# Altium schematic sheet Transformer.SchDoc
size 406 x 304 mm; SheetNumber: 1; SheetTotal: 4
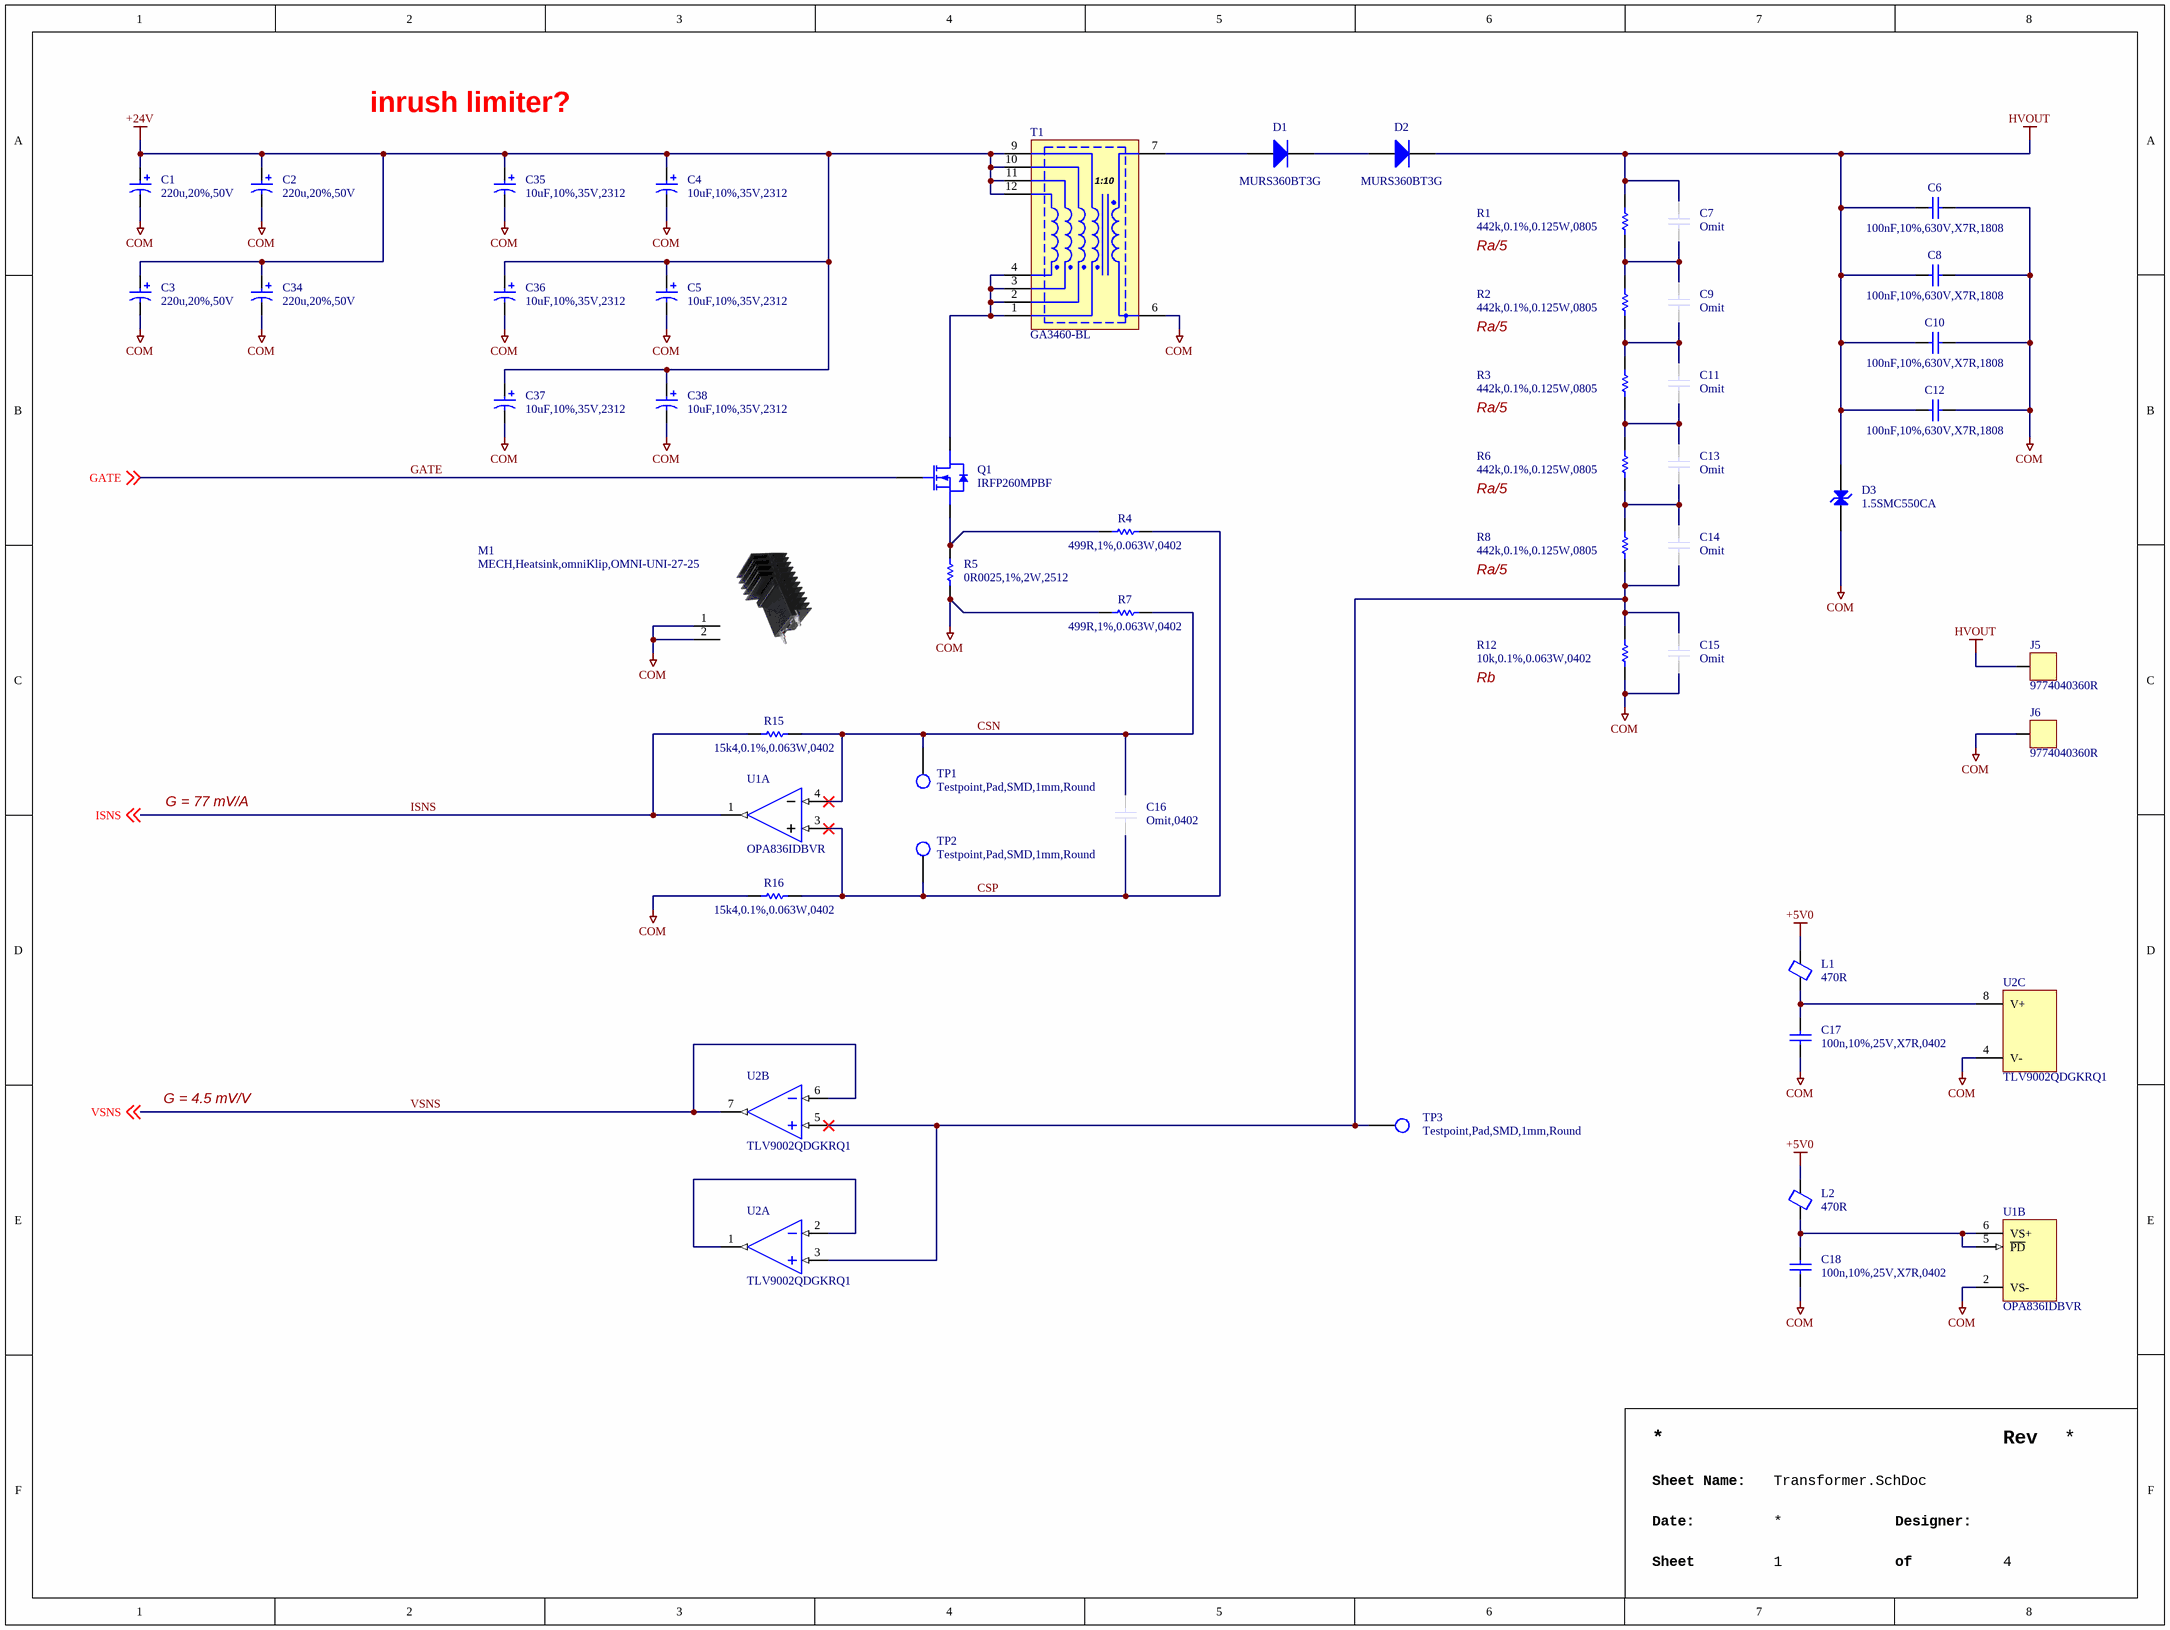
[diagram p0: Transformer.SchDoc]

## Parts
C1  220u,20%,50V  [CAPPR500W60D1000H1600B]
C2  220u,20%,50V  [CAPPR500W60D1000H1600B]
C3  220u,20%,50V  [CAPPR500W60D1000H1600B]
C4  10uF,10%,35V,2312  [KYOCERA_PKG_TAJC]
C5  10uF,10%,35V,2312  [KYOCERA_PKG_TAJC]
C6  100nF,10%,630V,X7R,1808  [KEMET_PKG_LC]
C7  Omit  [CAPC_0805]  (no BOM)
C8  100nF,10%,630V,X7R,1808  [KEMET_PKG_LC]
C9  Omit  [CAPC_0805]  (no BOM)
C10  100nF,10%,630V,X7R,1808  [KEMET_PKG_LC]
C11  Omit  [CAPC_0805]  (no BOM)
C12  100nF,10%,630V,X7R,1808  [KEMET_PKG_LC]
C13  Omit  [CAPC_0805]  (no BOM)
C14  Omit  [CAPC_0805]  (no BOM)
C15  Omit  [CAPC_0805]  (no BOM)
C16  Omit,0402  [CAPC1005X06N]  (no BOM)
C17  100n,10%,25V,X7R,0402  [CAPC1005X06N]
C18  100n,10%,25V,X7R,0402  [CAPC1005X06N]
C34  220u,20%,50V  [CAPPR500W60D1000H1600B]
C35  10uF,10%,35V,2312  [KYOCERA_PKG_TAJC]
C36  10uF,10%,35V,2312  [KYOCERA_PKG_TAJC]
C37  10uF,10%,35V,2312  [KYOCERA_PKG_TAJC]
C38  10uF,10%,35V,2312  [KYOCERA_PKG_TAJC]
D1  MURS360BT3G  [ONSEMI_SMB]
D2  MURS360BT3G  [ONSEMI_SMB]
D3  1.5SMC550CA  [LITTELFUSE_DO-214AB]
J5  9774040360R  [WURTH_9774040360R]
J6  9774040360R  [WURTH_9774040360R]
L1  470R  [INDC1005X05N]
L2  470R  [INDC1005X05N]
M1  MECH,Heatsink,omniKlip,OMNI-UNI-27-25  [WAKEFIELD_OMNI-UNI-27-25]
Q1  IRFP260MPBF  [INFINEON_PKG_TO247AD]
R1  442k,0.1%,0.125W,0805  [RESC2012X07N]
R2  442k,0.1%,0.125W,0805  [RESC2012X07N]
R3  442k,0.1%,0.125W,0805  [RESC2012X07N]
R4  499R,1%,0.063W,0402  [RESC1005X04N]
R5  0R0025,1%,2W,2512  [RALEC_PKG_2512]
R6  442k,0.1%,0.125W,0805  [RESC2012X07N]
R7  499R,1%,0.063W,0402  [RESC1005X04N]
R8  442k,0.1%,0.125W,0805  [RESC2012X07N]
R12  10k,0.1%,0.063W,0402  [RESC1005X04N]
R15  15k4,0.1%,0.063W,0402  [RESC1005X04N]
R16  15k4,0.1%,0.063W,0402  [RESC1005X04N]
T1  GA3460-BL  [COILCRAFT_GA3460-BL]
TP1  Testpoint,Pad,SMD,1mm,Round  [TP100]
TP2  Testpoint,Pad,SMD,1mm,Round  [TP100]
TP3  Testpoint,Pad,SMD,1mm,Round  [TP100]
U1  OPA836IDBVR  [TEXASINSTRUMENTS_PKG_DBV0006A]  (parts A,B of 2)
U2  TLV9002QDGKRQ1  [SOP65P490X110-8]  (parts A,B,C of 3)

## Nets
+5V0: L1.2 L2.2
+24V: C1.1 C2.1 C3.1 C4.1 C5.1 C34.1 C35.1 C36.1 C37.1 C38.1 T1.9 T1.10 T1.11 T1.12
COM: C1.2 C2.2 C3.2 C4.2 C5.2 C6.1 C8.1 C10.1 C12.1 C15.1 C17.1 C18.1 C34.2 C35.2 C36.2 C37.2 C38.2 D3.2(A) J6.0(PIN) M1.1 M1.2 R5.1 R7.1 R12.1 R16.1 T1.6 U1.2(VS-) U2.4(V-)
HVOUT: C6.2 C7.2 C8.2 C10.2 C12.2 D2.1(K) D3.1(K) J5.0(PIN) R1.2
CSN: C16.1 R7.2 R15.2 TP1.1(TP) U1.4(VIN-)
CSP: C16.2 R4.2 R16.2 TP2.1(TP) U1.3(VIN+)
GATE: Q1.1(G) ; off-sheet GATE
ISNS: R15.1 U1.1(VOUT) ; off-sheet ISNS
VSNS: U2.6(IN2-) U2.7(OUT2) ; off-sheet VSNS
NetC7_1: C7.1 C9.2 R1.1 R2.2
NetC9_1: C9.1 C11.2 R2.1 R3.2
NetC11_1: C11.1 C13.2 R3.1 R6.2
NetC13_1: C13.1 C14.2 R6.1 R8.2
NetC14_1: C14.1 C15.2 R8.1 R12.2 TP3.1(TP) U2.3(IN1+) U2.5(IN2+)
NetC17_2: C17.2 L1.1 U2.8(V+)
NetC18_2: C18.2 L2.1 U1.5(~{PD}) U1.6(VS+)
NetD1_1: D1.1(K) D2.2(A)
NetD1_2: D1.2(A) T1.7
NetQ1_2: Q1.2(D) T1.1 T1.2 T1.3 T1.4
NetQ1_3: Q1.3(S) R4.1 R5.2
NetU2_1: U2.1(OUT1) U2.2(IN1-)

## Notes on the sheet
- inrush limiter?
- Ra/5
- Rb
- G = 77 mV/A
- G = 4.5 mV/V
- Rev
- Sheet Name:
- Date:
- Sheet
- Designer:
- of
- (in symbol XFR,Flyback,COILCRAFT_GA3460-BL) 1:10

## Library data of the parts
C1-C3 C34 = CAP,Alum,220uF,20%,50VDC,Radial,Thru: 220 ï¿½F 50 V Aluminum Electrolytic Capacitors Radial, Can 5000 Hrs @ 105ï¿½C; Manufacturer 1: Rubycon; Manufacturer 1 Part Number: 50YXG220MEFCT810X16; Vendor 1 Part Number: 1189-3771-1-ND; Vendor 1: Digikey; Part Name: CAP,Alum,220uF,20%,50VDC,Radial,Thru; CreatedBy: Judd Foster; HelpURL: https://www.rubycon.co.jp/wp-content/uploads/catalog-aluminum/YXG.pdf; Value: 220u
C4 C5 C35-C38 = CAP,Tant,10uF,10%,35V,2312: 10 ÂµF Molded Tantalum Capacitors 35 V 2312 (6032 Metric) 1.6Ohm; Manufacturer 1: KYOCERA AVX; Manufacturer 1 Part Number: TAJC106K035RNJ; Vendor 1 Part Number: 478-1701-1-ND; Vendor 1: DigiKey; Part Name: CAP,Tant,10uF,10%,35V,2312; CreatedBy: Judd Foster; HelpURL: https://datasheets.kyocera-avx.com/TAJ.pdf
C6 C8 C10 C12 = CAP,Cer,100nF,10%,630V,X7R,1808: 0.1 ÂµF Â±10% 630V Ceramic Capacitor X7R 1808 (4520 Metric); Manufacturer 1: KEMET; Manufacturer 1 Part Number: C1808C104KBRAC7800; Vendor 1 Part Number: 399-C1808C104KBRAC7800CT-ND; Vendor 1: DigiKey; Part Name: CAP,Cer,100nF,10%,630V,X7R,1808; CreatedBy: Judd Foster; HelpURL: https://content.kemet.com/datasheets/KEM_C1010_X7R_HV_SMD.pdf; Value: 100nF
C7 C9 C11 C13-C15 = CAP,Omit,0805: Part Name: CAP,Omit,0805; CreatedBy: Judd Foster; HelpURL: N/A; Manufacturer 1: N/A; Manufacturer 1 Part Number: N/A; Vendor 1: N/A; Vendor 1 Part Number: N/A; Value: Omit
C16 = CAP,Omit,0402: Omit; Part Name: CAP,Omit,0402; CreatedBy: Judd Foster; HelpURL: N/A; Manufacturer 1: N/A; Manufacturer 1 Part Number: N/A; Vendor 1: N/A; Vendor 1 Part Number: N/A; Value: Omit
C17 C18 = CAP,Cer,100nF,10%,25V,X7R,0402: 0.1ï¿½F ï¿½10% 25V Ceramic Capacitor X7R 0402 (1005 Metric); Manufacturer 1: Murata Electronics; Manufacturer 1 Part Number: GRM155R71E104KE14J; Vendor 1 Part Number: 490-14603-1-ND; Vendor 1: DigiKey; Value: 100nF; Part Name: CAP,Cer,100nF,10%,25V,X7R,0402; CreatedBy: Judd Foster; HelpURL: https://search.murata.co.jp/Ceramy/image/img/A01X/G101/ENG/GRM155R71E104KE14-01.pdf
D1 D2 = Diode,Gen,600V,3A,SMB: Diode 600 V 3A Surface Mount SMB; Manufacturer 1: onsemi; Vendor 1 Part Number: MURS360BT3GOSCT-ND; Vendor 1: Digikey; Part Name: Diode,Gen,600V,3A,SMB; CreatedBy: Judd Foster; HelpURL: https://www.onsemi.com/pdf/datasheet/murs360bt3-d.pdf; Manufacturer 1 Part Number: MURS360BT3G
D3 = DIODE,TVS,495VWM,SMD: 760V Clamp 2A Ipp Tvs Diode Surface Mount DO-214AB (SMCJ); Manufacturer 1: Littelfuse Inc.; Vendor 1 Part Number: 1.5SMC550CACT-ND; Vendor 1: Digikey; Part Name: DIODE,TVS,495VWM,SMD; CreatedBy: Judd Foster; HelpURL: https://www.littelfuse.com/~/media/electronics/datasheets/tvs_diodes/littelfuse_tvs_diode_1_5smc_datasheet.pdf.pdf; Manufacturer 1 Part Number: 1.5SMC550CA
J5 J6 = Mech,Standoff,M3,4mm,SMD: Round Standoff Threaded M3x0.5 Steel 0.157" (4.00mm); Manufacturer 1: Wï¿½rth Elektronik; Vendor 1 Part Number: 732-5271-1-ND; Vendor 1: Digikey; Part Name: Mech,Standoff,M3,4mm,SMD; CreatedBy: Judd Foster; HelpURL: https://www.we-online.com/katalog/datasheet/9774040360R.pdf; Manufacturer 1 Part Number: 9774040360R
L1 L2 = Ferrite,470R@100MHz,0402: 470 Ohms @ 100 MHz 1 Power Line Ferrite Bead 0402 (1005 Metric) 1A 200mOhm; Manufacturer 1: Murata Electronics; Manufacturer 1 Part Number: BLM15PX471SN1D; Vendor 1 Part Number: 490-10662-1-ND; Vendor 1: Digikey; Part Name: Ferrite,470R@100MHz,0402; CreatedBy: Judd Foster; HelpURL: https://www.murata.com/en-us/products/productdata/8796740059166/ENFA0018.pdf; Value: 470R
M1 = MECH,Heatsink,omniKlip,OMNI-UNI-27-25: Heat Sink TO-220, TO-247, TO-264 Aluminum Board Level, Vertical; Manufacturer 1: Wakefield-Vette; Vendor 1 Part Number: 345-1567-ND; Vendor 1: DigiKey; Part Name: MECH,Heatsink,omniKlip,OMNI-UNI-27-25; CreatedBy: Judd Foster; HelpURL: https://wakefieldthermal.com/content/data_sheets/OMNIKLIP/omniKlip%20Wakefield%20Vette.pdf; Manufacturer 1 Part Number: OMNI-UNI-27-25
Q1 = MOSFET,N Ch,200V,50A,IRFP260MPBF: N-Channel 200 V 50A (Tc) 300W (Tc) Through Hole TO-247AC; Manufacturer 1: Infineon Technologies; Vendor 1 Part Number: IRFP260MPBF-ND; Vendor 1: DigiKey; Part Name: MOSFET,N Ch,200V,50A,IRFP260MPBF; CreatedBy: Judd Foster; HelpURL: https://www.infineon.com/dgdl/irfp260mpbf.pdf?fileId=5546d462533600a40153562894e91fe0; Manufacturer 1 Part Number: IRFP260MPBF
R1-R3 R6 R8 = RES,442k,0.1%,0.125W,0805: 442 kOhms Â±0.1% 0.125W, 1/8W Chip Resistor 0805 (2012 Metric) Automotive AEC-Q200 Thin Film; Manufacturer 1: Panasonic Electronic Components; Manufacturer 1 Part Number: ERA-6AEB4423V; Vendor 1 Part Number: P442KDACT-ND; Vendor 1: DigiKey; Part Name: RES,442k,0.1%,0.125W,0805; CreatedBy: Judd Foster; HelpURL: https://industrial.panasonic.com/cdbs/www-data/pdf/RDM0000/AOA0000C307.pdf; Value: 442k
R4 R7 = RES,499R,1%,0.063W,0402: 62.5mW Thick Film Resistors 50V Â±100ppm/â„ƒ Â±1% 499Î© 0402 Chip Resistor - Surface Mount ROHS; Manufacturer 1: YAGEO; Manufacturer 1 Part Number: RC0402FR-07499RL; Vendor 1 Part Number: C137970; Vendor 1: LCSC; Part Name: RES,499R,1%,0.063W,0402; CreatedBy: Judd Foster; HelpURL: https://lcsc.com/datasheet/lcsc_datasheet_2304140030_YAGEO-RC0402FR-07499RL_C137970.pdf
R5 = RES,0R0025,1%,2W,2512: 2W Â±1% 2.5mÎ© 2512 Chip Resistor - Surface Mount ROHS; Manufacturer 1: RALEC; Manufacturer 1 Part Number: C2681064; Vendor 1: LCSC; Part Name: RES,0R0025,1%,2W,2512; CreatedBy: Judd Foster; HelpURL: https://lcsc.com/datasheet/lcsc_datasheet_2412031558_RALEC-LR2512-22R0025F4_C2681064.pdf; Vendor 1 Part Number: C2681064
R12 = RES,10k,0.1%,0.063W,0402: 10 kOhms ï¿½0.1% 0.1W, 1/10W Chip Resistor 0402 (1005 Metric) Automotive AEC-Q200 Thin Film; Manufacturer 1: Stackpole Electronics Inc; Manufacturer 1 Part Number: RNCF0402BTE10K0; Vendor 1 Part Number: RNCF0402BTE10K0CT-ND; Vendor 1: Digikey; Part Name: RES,10k,0.1%,0.063W,0402; CreatedBy: Judd Foster; HelpURL: https://www.seielect.com/catalog/sei-rncf.pdf; Value: 10k
R15 R16 = RES,15k4,0.1%,0.063W,0402: 15.4 kOhms Â±0.1% 0.063W, 1/16W Chip Resistor 0402 (1005 Metric) Thin Film; Manufacturer 1: YAGEO; Manufacturer 1 Part Number: RT0402BRD0715K4L; Vendor 1 Part Number: YAG4177CT-ND; Vendor 1: DigiKey; Part Name: RES,15k4,0.1%,0.063W,0402; CreatedBy: Judd Foster; HelpURL: https://www.yageo.com/upload/media/product/app/datasheet/rchip/pyu-rt_1-to-0.01_rohs_l.pdf; Value: 15k4
T1 = XFR,Flyback,COILCRAFT_GA3460-BL: Audio Transformers / Signal Transformers GA3460 for LT3751 500V 50A; Vendor 1 Part Number: 994-GA3460-BL; Vendor 1: Mouser; Part Name: XFR,Flyback,COILCRAFT_GA3460-BL; CreatedBy: Judd Foster; HelpURL: https://www.mouser.ca/datasheet/2/597/ga3459-463457.pdf; Manufacturer 1: Coilcraft; Manufacturer 1 Part Number: GA3460-BL
TP1-TP3 = Testpoint,Pad,SMD: PCB Testpoint 1mm Round; Part Name: Testpoint,Pad,SMD; CreatedBy: Judd Foster; HelpURL: N/A; Manufacturer 1: N/A; Manufacturer 1 Part Number: N/A; Vendor 1: N/A; Vendor 1 Part Number: N/A
U1 = OPA836IDBVR: Voltage Feedback Amplifier 1 Circuit Rail-to-Rail SOT-23-6; Manufacturer 1: Texas Instruments; Vendor 1 Part Number: 296-44388-1-ND; Vendor 1: DigiKey; Part Name: OPA836IDBVR; CreatedBy: Judd Foster; HelpURL: https://www.ti.com/lit/ds/symlink/opa836.pdf?HQS=dis-dk-null-digikeymode-dsf-pf-null-wwe&ts=1741112370606&ref_url=https%253A%252F%252Fwww.ti.com%252Fgeneral%252Fdocs%252Fsuppproductinfo.tsp%253FdistId%253D10%2526gotoUrl%253Dhttps%253A%252F%252Fwww.ti.com%; Manufacturer 1 Part Number: OPA836IDBVR
U2 = TLV9002QDGKRQ1: General Purpose Amplifier Circuit Rail-to-Rail 8-VSSOP; Manufacturer 1: Texas Instruments; Vendor 1 Part Number: 296-TLV9002QDGKRQ1CT-ND; Vendor 1: Digikey; Part Name: TLV9002QDGKRQ1; CreatedBy: Judd Foster; HelpURL: https://www.ti.com/lit/ds/symlink/tlv9001-q1.pdf?ts=1702270446565&ref_url=https%253A%252F%252Fwww.google.com%252F; Manufacturer 1 Part Number: TLV9002QDGKRQ1